# EAGLE design LB_BIT_p2_COINBATTERY-v03(rev3) (EAGLE 6.6.0)
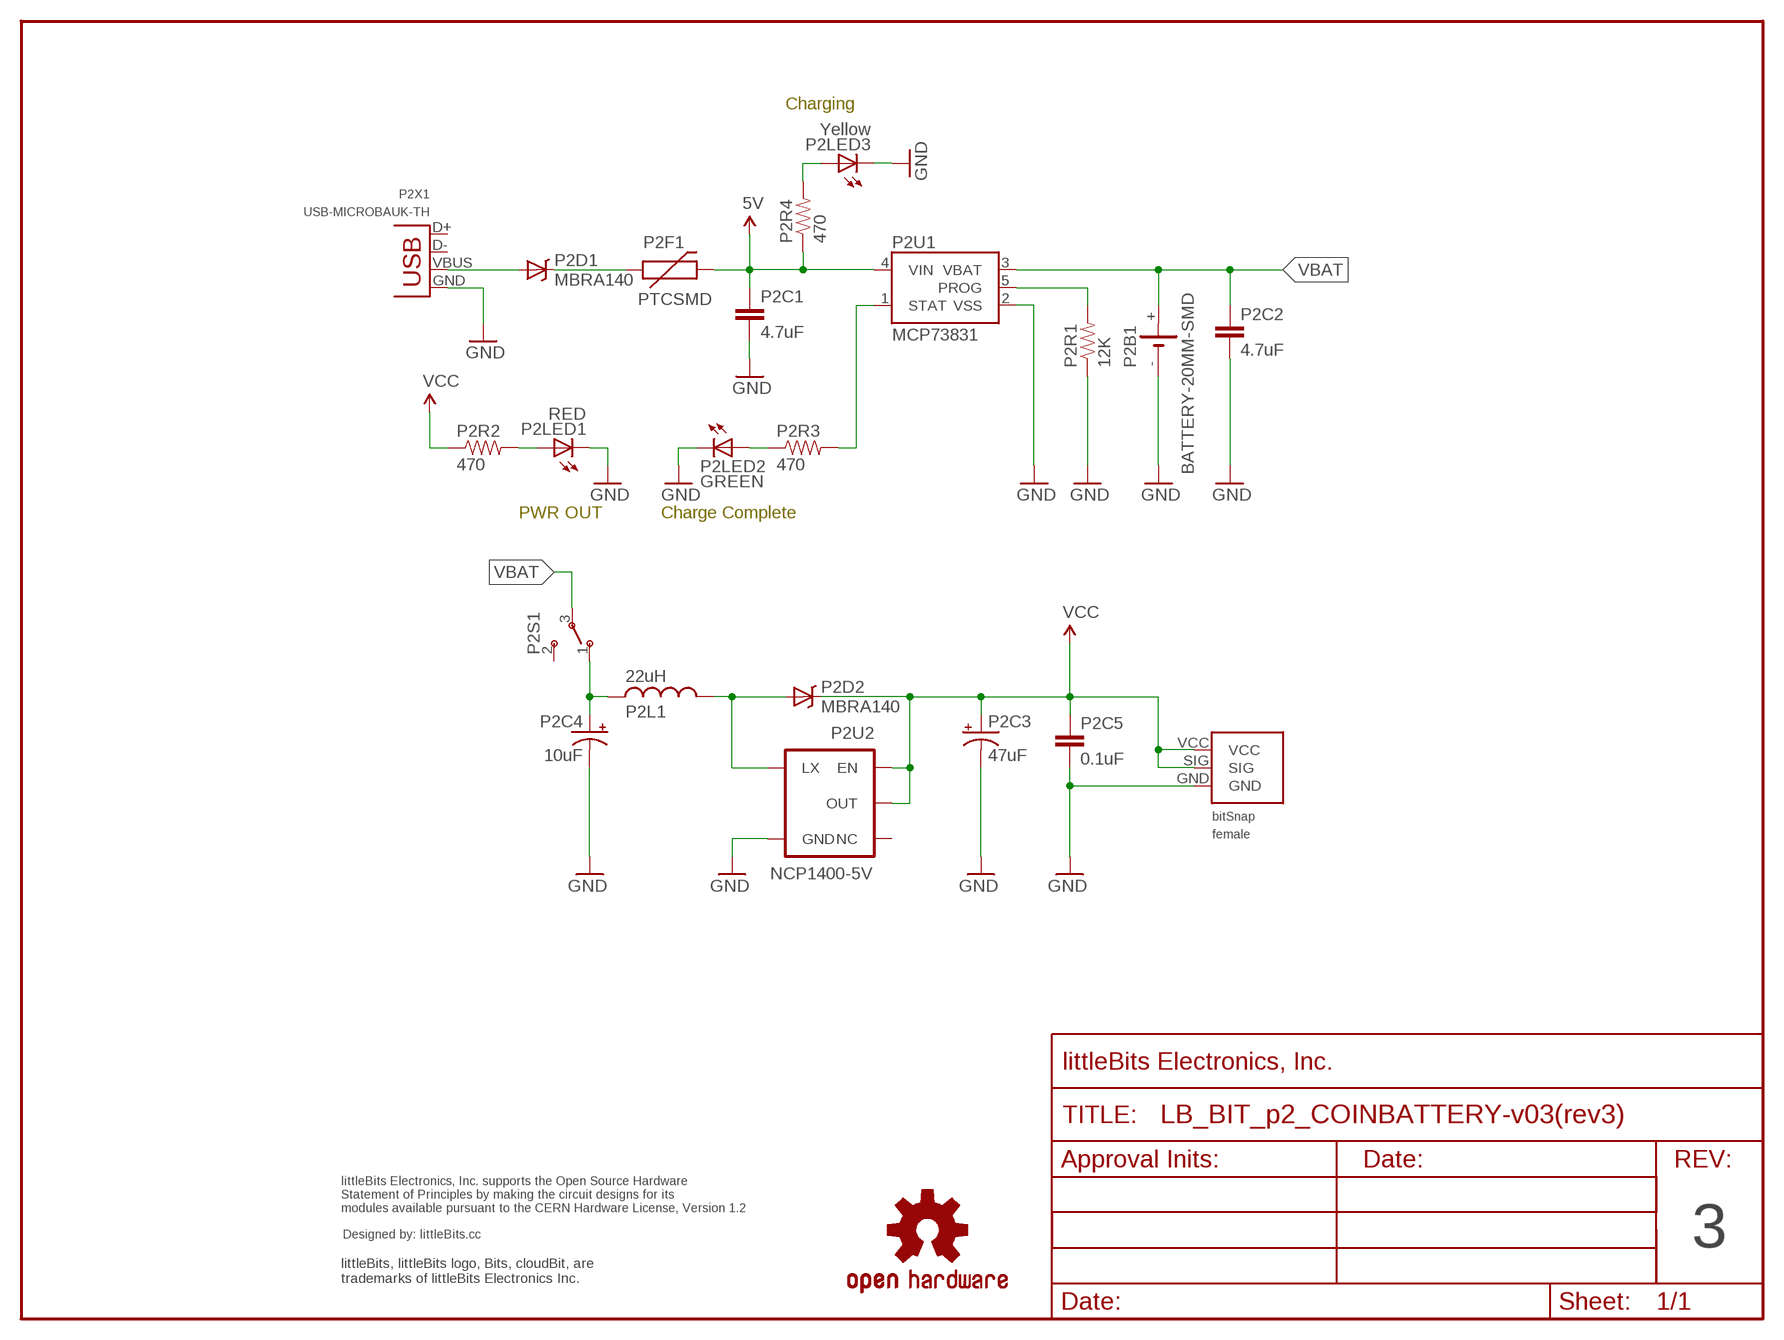
[diagram p0: schematic, sheet 1]

## Parts
P2B1  BATTERY-20MM-SMD  [BATTERY_WELDTABS-20MM-SMD]
P2BSF1  BITSNAP_V03_FEMALE  [BITSNAP_V03_FEMALE]
P2C1  4.7uF  CAP0603-CAP  [0603-CAP]
P2C2  4.7uF  CAP0603-CAP  [0603-CAP]
P2C3  47uF  CAP_POL3528  [EIA3528]
P2C4  10uF  CAP_POL1206  [EIA3216]
P2C5  0.1uF  CAP0603-CAP  [0603-CAP]
P2D1  MBRA140  DIODE-SCHOTTKY_  [SMA-DIODE]
P2D2  MBRA140  DIODE-SCHOTTKY_  [SMA-DIODE]
P2F1  PTCSMD  [PTC-1206]
P2L1  22uH  INDUCTOR-TAITO_YUDEN_NR6028T220M  [INDUCTOR-TAITO_YUDEN_NR6028T220M]
P2LED1  RED  LED1206  [LED-1206]
P2LED2  GREEN  LED1206  [LED-1206]
P2LED3  Yellow  LED1206  [LED-1206]
P2R1  12K  RESISTOR0603-RES  [0603-RES]
P2R2  470  RESISTOR0603-RES  [0603-RES]
P2R3  470  RESISTOR0603-RES  [0603-RES]
P2R4  470  RESISTOR0603-RES  [0603-RES]
P2S1  SWITCH-SMD-SLIDE-CSS1210TB  [COPAL_CSS1210TB]
P2U1  MCP73831  [SOT23-5]
P2U2  NCP1400-5V  V_REG_NCP1400SOT23-5  [SOT23-5]
P2X1  USB-MICROBAUK-TH  [USB-MICROB-AUK]
U$3  OSHWCREDIT  [OSHWCREDIT]
U$4  OSHW-LOGOL  [OSHW-LOGO-L]
U$6  FRAME-LETTER-OHWOHW  [FABDWG01-OHW]

## Nets
5V: P2C1.1 P2F1.2 P2R4.1 P2U1.4(VIN)
GND: P2B1.- P2BSF1.GND P2C1.2 P2C2.2 P2C3.C(-) P2C4.C(-) P2C5.2 P2LED1.C P2LED2.C P2LED3.C P2R1.1 P2U1.2(VSS) P2U2.4(GND) P2X1.GND
N$1: P2D1.A P2X1.VBUS
N$2: P2D1.C P2F1.1
N$3: P2LED3.A P2R4.2
N$4: P2LED1.A P2R2.2
N$5: P2LED2.A P2R3.1
N$16: P2D2.A P2L1.P$1 P2U2.5(LX)
PROG: P2R1.2 P2U1.5(PROG)
RAW: P2C4.A(+) P2L1.P$2 P2S1.1
STAT: P2R3.2 P2U1.1(STAT)
VBAT: P2B1.+ P2C2.1 P2S1.3 P2U1.3(VBAT)
VCC: P2BSF1.SIG P2BSF1.VCC P2C3.A(+) P2C5.1 P2D2.C P2R2.1 P2U2.1(EN) P2U2.2(OUT)
Unconnected: P2S1.2 P2U2.3(NC) P2X1.D+ P2X1.D-

## Notes on the sheet
- Charging
- PWR OUT | Charge Complete
- 3

## Library data of the parts
P2B1 = LITTLEBITS:BATTERY-20MM-SMD
P2BSF1 = bitSnap:BITSNAP_V03_FEMALE
P2C1 P2C2 P2C5 = SparkFun:CAP: Capacitor Standard 0603 ceramic capacitor, and 0.1" leaded capacitor.
P2C3 P2C4 = SparkFun:CAP_POL: Capacitor Polarized These are standard SMD and PTH capacitors. Normally 10uF, 47uF, and 100uF in electrolytic and tantalum varieties. Always verify the external diameter of the through hole cap, it varies with capacity, voltage, and manufacturer. The EIA devices should be standard.
P2D1 P2D2 = SparkFun:DIODE-SCHOTTKY
P2F1 = SparkFun:PTC: Resettable Fuse PTC Resettable Fuse. Spark Fun Electronics SKU : COM-08357
P2L1 = LITTLEBITS:INDUCTOR-TAITO_YUDEN_NR6028T220M
P2LED1-P2LED3 = SparkFun:LED: LEDs Standard schematic elements and footprints for 5mm, 3mm, 1206, and 0603 sized LEDs. 5mm - Spark Fun Electronics SKU : COM-00529 (and others)
P2R1-P2R4 = SparkFun:RESISTOR: Resistor Basic schematic elements and footprints for 0603, 1206, and PTH 1/10th watt (small) resistors.
P2S1 = LITTLEBITS:SWITCH-SMD-SLIDE-CSS1210TB: Copal Electronics Compact Slide Switch CSS1210TB
P2U1 = SparkFun:MCP73831: Microchip's MCP73831 Miniature single cell, fully integrated Li-Ion, Li-polymer charge management controller http://ww1.microchip.com/downloads/en/DeviceDoc/21984a.pdf
P2U2 = SparkFun:V_REG_NCP1400: Switching step-up voltage regulator NCP1400 switiching regulator takes single cell AA and outputs 100mA at 3.3V or 5V with minimal number of external components.
P2X1 = LITTLEBITS:USB-MICROB: Hirose Electric Co Ltd ZX62-B-5PA(11)
U$3 = LITTLEBITS:OSHWCREDIT
U$4 = SparkFun_NEW:OSHW-LOGO: Open Source Hardware Logo This logo indicates the piece of hardware it is found on incorporates a OSHW license and/or adheres to the definition of open source hardware found here: http://freedomdefined.org/OSHW
U$6 = LITTLEBITS:FRAME-LETTER-OHW

## Net classes
0 Default: width 0.203 mm

## Board
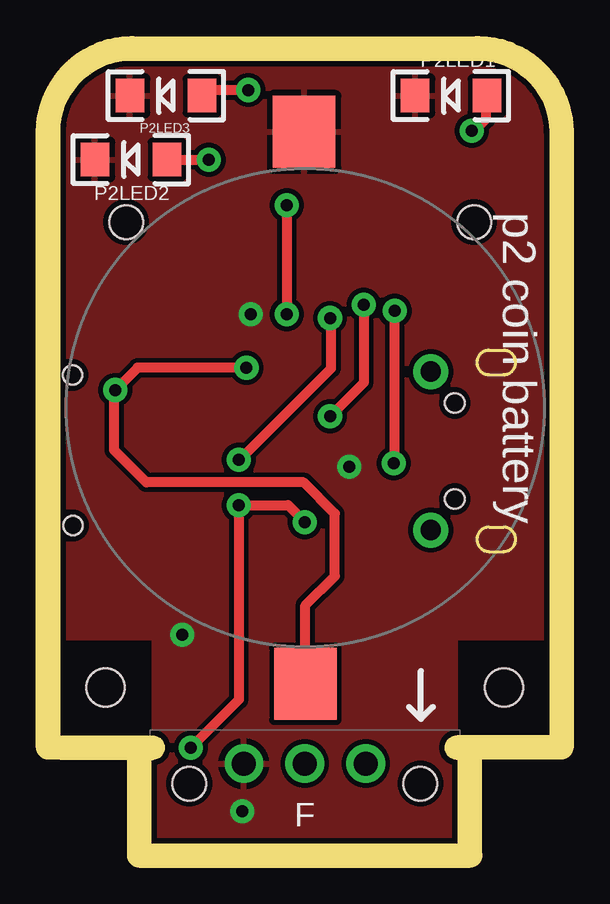
[diagram p1: board, top side]
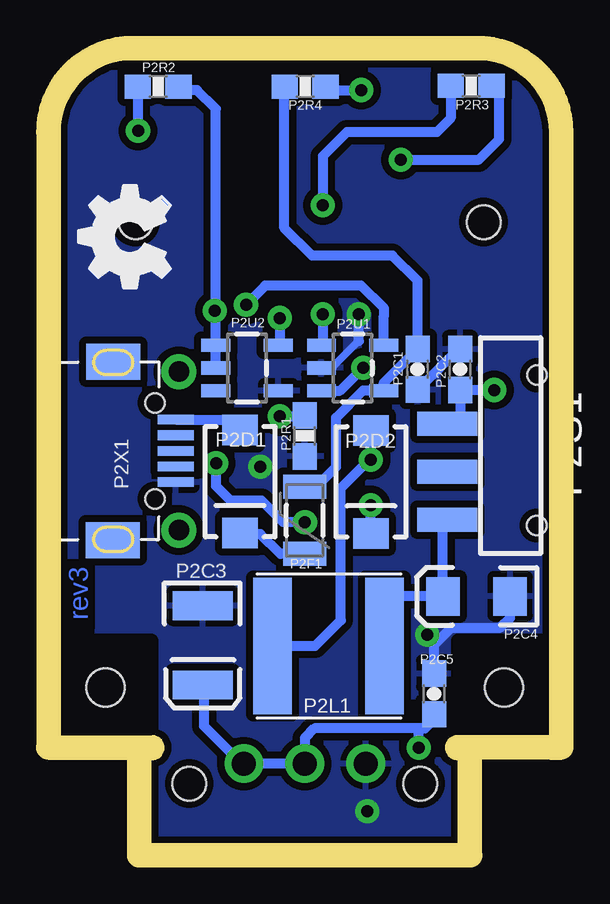
[diagram p2: board, bottom side, seen from below]

Size 20.4 x 32.65 mm. Coordinates in mm from the lower left corner, seen from the top.
Outline: 0,4.5 0,29.65
Outline: 0,29.65 0,29.71
Outline: 20.4,4.5 20.4,29.65 arc90 17.4,32.65 3,32.65 arc90 0,29.65
Copper layers (1*16): Top 0.035mm / dielectric 1.5mm / Bottom 0.035mm
Design rules "default": minimum track width 8mil, minimum drill 20mil, track to track 8mil, track to pad 8mil, pad to pad 8mil, via to via 8mil, smd to smd 8mil, copper to edge 10mil, drill to drill 8mil, minimum pad ring 12mil, minimum via ring 10mil, stop-mask expansion 4mil, vias tented up to drill 25mil, thermal gap 10mil
Holes 1.6 mm at 1.9,6.5 18.5,6.5
tRestrict: area 16.6,4.5 to 20.4,8.5; area 0,4.5 to 3.8,8.5
bRestrict: area 16.6,4.5 to 20.4,8.5; area 0,4.5 to 3.8,8.5
Milling: 7 lines

### Footprints (pad centres in the part's own frame; a part is rotated, then mirrored left to right if it is on the bottom)
BATTERY_WELDTABS-20MM-SMD = smd 3 x 2.6: + -11.45,0; - 11.55,0.05
BITSNAP_V03_FEMALE = drill 1: GND 3.91,3.33; SIG 6.45,3.33; VCC 8.99,3.33 | hole 1.4: 1.63,2.5; 11.27,2.5
0603-CAP = smd 1.1 x 1: 1 -0.85,0; 2 0.85,0
EIA3528 = smd 1.2 x 2.5: A 1.65,0; C -1.65,0
EIA3216 = smd 1.4 x 1.6: A 1.4,0; C -1.4,0
SMA-DIODE = smd 1.27 x 1.47: A -2.15,0; C 2.15,0
PTC-1206 = smd 1 x 1.8: 1 -1.4,0; 2 1.4,0
INDUCTOR-TAITO_YUDEN_NR6028T220M = smd 1.6 x 5.7: P$1 0.025,0; P$2 4.7,0
LED-1206 = smd 1.2 x 1.4: A -1.5,0; C 1.5,0
0603-RES = smd 1.1 x 1: 1 -0.85,0; 2 0.85,0
COPAL_CSS1210TB = smd 1 x 2.5: 1 1.499,3.842; 2 3.504,3.842; 3 5.499,3.829 | hole 0.8: 1.262,0.102; 7.525,0.09
SOT23-5 = smd 0.55 x 1.2: 1 -0.95,-1.3; 2 0,-1.3; 3 0.95,-1.3; 4 0.95,1.3; 5 -0.95,1.3
USB-MICROB-AUK = smd 0.4 x 1.5: D+ 0,4.37; D- -0.65,4.37; GND 1.3,4.37; ID 0.65,4.37; VBUS -1.3,4.37 | drill 0.85: P$1 -3.3,4.5; P$2 3.3,4.5 | smd 1.5 x 2.25: P$3 -3.725,1.775; P$4 3.725,1.75 | hole 0.8: -2,3.5; 2,3.5
LB_PWR_LEGS = hole 1.4: 2.75,4.4; 17.25,4.4

### Placement (x,y rotation side)
P2B1  10.22,18.11 90 top
P2BSF1  3.75,0 0 top
P2C1  5.5,19.76 270 bottom
P2C2  3.73,19.76 90 bottom
P2C3  14.45,8.26 270 bottom
P2C4  3.04,10.3 180 bottom
P2C5  4.81,6.24 90 bottom
P2D1  12.89,15.08 270 bottom
P2D2  7.45,15.07 270 bottom
P2F1  10.2,13.47 90 bottom
P2L1  11.57,8.23 0 bottom
P2LED1  16.29,31.17 180 top
P2LED2  2.96,28.5 180 top
P2LED3  4.41,31.17 180 top
P2R1  10.2,16.98 90 bottom
P2R2  16.31,31.55 180 bottom
P2R3  3.27,31.57 180 bottom
P2R4  10.18,31.55 0 bottom
P2S1  0.43,12 90 bottom
P2U1  8.21,19.82 270 bottom
P2U2  12.61,19.82 270 bottom
P2X1  19.95,16.36 270 bottom
U$1  [LB_PWR_LEGS]  0,21.5 0 top
U$3  -92.55,-62.55 0 top  (outside the outline)
U$4  -33.1,-68.06 0 top  (outside the outline)
U$5  [OSHW_FILLX150_NOTEXT]  15.81,22.33 0 top
U$6  0.15,0.15 0 top

### Tracks (layer width: path | path; a pad name or v marks a point on that pad's centre or on a via)
5V
  Bottom 0.406: P2F1.2 9.73,14.87 8.9,15.7 8.9,17.75 7.78,18.87 P2U1.4 6.91,19.21 P2C1.1 5.5,23.45 6.55,24.5 9.9,24.5 11.05,25.65 11.05,31.38 P2R4.1
GND  (via drill 0.5)
  Bottom 0.305: 9.08,19.82 7.95,20.95
  Bottom 0.406: P2C2.2 3.81,20.6 P2C1.2 | P2C5.2 4.81,8.29 4.1,9 2.05,9 1.65,9.4 P2C4.C | P2U1.2 9.08,19.82 | 7.95,20.95 v7.95,22.05
  other vias: 7.6,1.35 5.1,8.7 12.05,15.7
  pour Bottom (isolate 0.305): 0.15,32.54 0.15,0.15 20.25,0.15 20.25,32.55
  pour Top: 0.15,32.55 20.25,32.55 20.25,0.15 0.15,0.15
N$1
  Bottom 0.406: P2X1.VBUS 13.32,17.66 P2D1.A
N$2
  Bottom 0.406: P2F1.1 11.22,12.07 12.05,12.9 12.86,12.9 P2D1.C
N$3  (via drill 0.5)
  Top 0.406: v7.85,31.4 6.15,31.4 P2LED3.A
  Bottom 0.406: P2R4.2 9.35,31.4 9.34,31.4 v7.85,31.4
N$4  (via drill 0.5)
  Top 0.406: v17.15,29.7 17.25,29.7 17.75,30.2 17.75,31.12 P2LED1.A
  Bottom 0.406: P2R2.2 17.16,29.71 v17.15,29.7
N$5  (via drill 0.5)
  Top 0.406: P2LED2.A v6.2,28.5
  Bottom 0.406: v6.2,28.5 2.95,28.5 2.1,29.35 2.1,31.35 P2R3.1
N$16  (via drill 0.5)
  Top 0.406: v7.45,16 7.45,15.95 11.3,19.8 11.3,21.85 v11.25,21.9
  Bottom 0.406: P2L1.P$1 9.77,8.23 8.7,9.3 8.7,14.8 7.45,16.05 | 7.45,16.05 P2D2.A 7.45,16.05 | 7.45,16.05 v7.45,16 | v11.25,21.9 11.25,20.83 P2U2.5
PROG  (via drill 0.5)
  Top 0.406: v12.65,22.45 12.65,19.2 v11.25,17.8
  Bottom 0.406: 10.05,17.95 P2R1.2 10.2,17.8 v11.25,17.8 | P2U1.5 6.91,21.99 6.9,22 6.9,22.3 7.85,23.25 11.85,23.25 v12.65,22.45
RAW
  Bottom 0.406: P2L1.P$2 6.75,8.36 6.75,10.3 P2C4.A 4.44,13.33 P2S1.1
STAT  (via drill 0.5)
  Top 0.406: v9.45,26.6 v9.45,22.05
  Bottom 0.406: P2R3.2 4.12,30.23 4.7,29.65 8.45,29.65 9.45,28.65 v9.45,26.6 | v9.45,22.05 9.45,20.83 P2U1.1
VBAT  (via drill 0.5)
  Top 0.406: v7.77,19.83 3.23,19.83 v2.3,18.9 2.25,18.85 2.25,16.4 3.6,15.05 10.15,15.05 11.45,13.75 11.45,11.15 10.22,9.92 P2B1.+
  Bottom 0.406: P2S1.3 4.21,17.55 3.7,17.55 3.73,17.58 P2C2.1 v2.3,18.9 | P2U1.3 8.73,18.87 v7.77,19.83
VCC  (via drill 0.5)
  Top 0.406: v5.45,4 7.45,6 v7.45,14.1 v7.45,14.09 9.5,14.1 v10.2,13.39 | v13.95,22.2 13.95,15.9 v13.9,15.85
  Bottom 0.406: P2C5.1 4.81,5.18 5.2,4.8 5.4,4.8 | 5.4,4.8 9.8,4.8 10.2,4.4 P2BSF1.SIG P2BSF1.VCC 12.83,3.33 14.4,4.9 14.4,6.56 P2C3.A | P2U2.2 P2U2.1 13.91,22.3 | v5.45,4 5.45,4.75 5.4,4.8 | 13.91,22.3 13.91,30.61 14.7,31.4 15.46,31.4 P2R2.1 | v13.95,22.2 v13.96,22.2 13.91,22.3 | v10.2,13.39 11.1,13.4 11.99,14.3 13.29,14.3 13.9,14.9 v13.9,15.85 | P2D2.C v7.45,14.09 v7.45,14.1

### Text on the board
Bottom: rev3
tPlace: p2 coin battery
Milling: 1mm DIA. ROUTER PATH
Reference: LARGE
dxf: 3 | p2 COIN BATTERY BIT PCB | LB-BIT-p2-COINBATTERY-v03-GERBER-rev3 (9-6-2012)